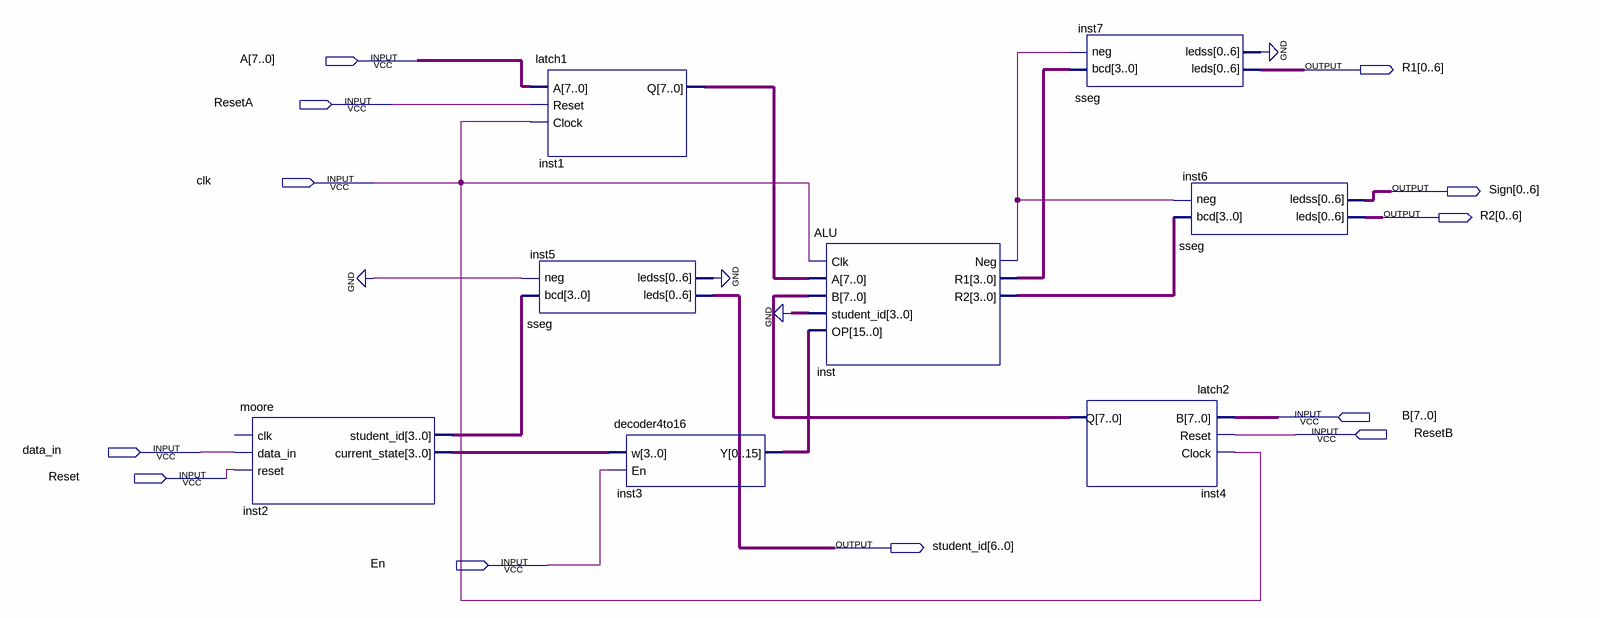
[diagram p0: schematic sheet]
// Quartus schematic Part1ALU.bdf as structural Verilog: 8 symbols, 12 pins
module Part1ALU (
  input  [7:0] A,
  input  ResetA,
  input  clk,
  input  [7:0] B,
  input  ResetB,
  input  data_in,
  input  Reset,
  input  En,
  output [0:6] R1,
  output [0:6] Sign,
  output [0:6] R2,
  output [6:0] student_id
);

  wire inst_neg;
  wire [3:0] inst2_current_state, inst2_student_id, inst_r1, inst_r2;
  wire [6:0] inst5_ledss, inst7_ledss;
  wire [7:0] inst1_q, inst4_q;
  wire [15:0] inst3_y;

  moore inst2 (
    .data_in(data_in), .reset(Reset), .student_id(inst2_student_id), .current_state(inst2_current_state));  // open: clk
  latch1 inst1 (.A(A), .Reset(ResetA), .Clock(clk), .Q(inst1_q));
  sseg inst5 (.bcd(inst2_student_id), .neg(1'b0), .leds(student_id), .ledss(inst5_ledss));
  decoder4to16 inst3 (.w(inst2_current_state), .En(En), .Y(inst3_y));
  ALU inst (
    .Clk(clk), .A(inst1_q), .B(inst4_q), .student_id(4'b0000), .OP(inst3_y), .Neg(inst_neg), .R1(inst_r1),
    .R2(inst_r2));
  sseg inst7 (.bcd(inst_r1), .neg(inst_neg), .leds(R1), .ledss(inst7_ledss));
  latch2 inst4 (.B(B), .Reset(ResetB), .Clock(clk), .Q(inst4_q));
  sseg inst6 (.bcd(inst_r2), .neg(inst_neg), .leds(R2), .ledss(Sign));
  // also tied to GND on the sheet: {inst5_ledss[0], inst5_ledss[1], inst5_ledss[2], inst5_ledss[3], inst5_ledss[4], inst5_ledss[5], inst5_ledss[6], inst7_ledss[0], inst7_ledss[1], inst7_ledss[2], inst7_ledss[3], inst7_ledss[4], inst7_ledss[5], inst7_ledss[6]}
endmodule
